# Altium schematic sheet Sheet1.SchDoc
size A4
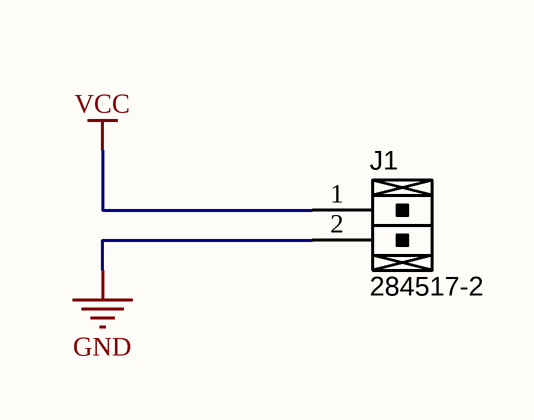
[diagram p0: Sheet1.SchDoc]

## Parts
J1  Manufacturer Part Number 1: 284517-2  [2P_PCB_TERM_BLOCK_HDR]  (hidden comment: 2P_TERM_BLOCK_HEADER)

## Nets
GND: J1.2
VCC: J1.1

## Library data of the parts
J1 = 2P_TERM_BLOCK_HEADER: Terminal Block THT 2-position header 3.81mm pitch; Manufacturer 1: TE Connectivity; Pitch: 0.150" (3.81mm); Voltage: 300V; Positions Per Level: 2; Mating Connector: 284507-2; SCDType: undef; Category: Connectors; Mounting Type: Through Hole; Terminal Block Type: Header, Male Pins, Right-angle, Shrouded (4 Side); Package / Case: Header; 3.81mm pitch; Supplier 1: Digi-Key; Supplier Part Number 1: A98410-ND